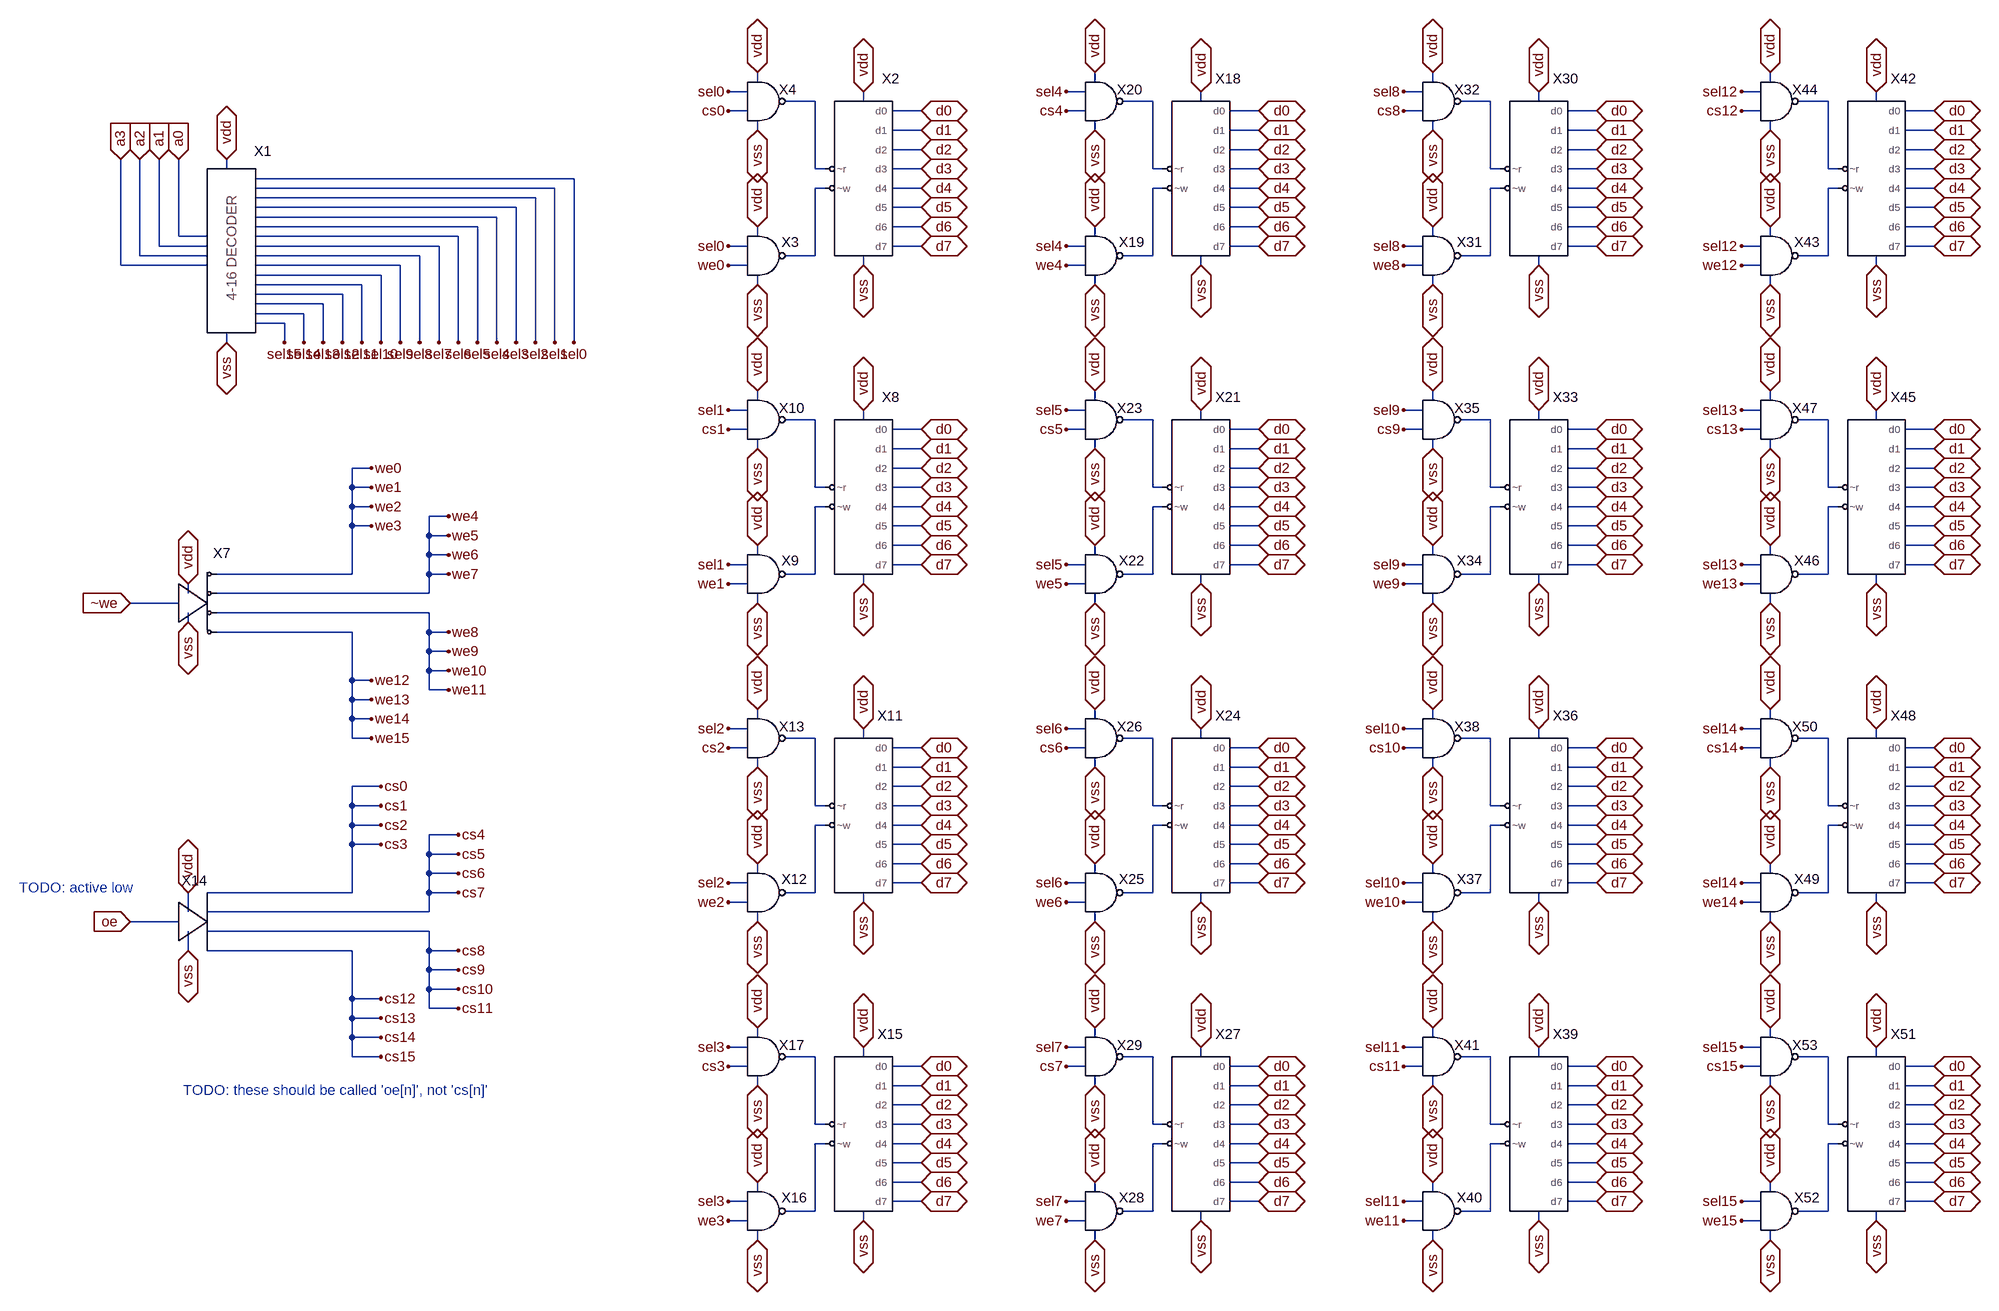
[diagram p0: schematic sram.asc]
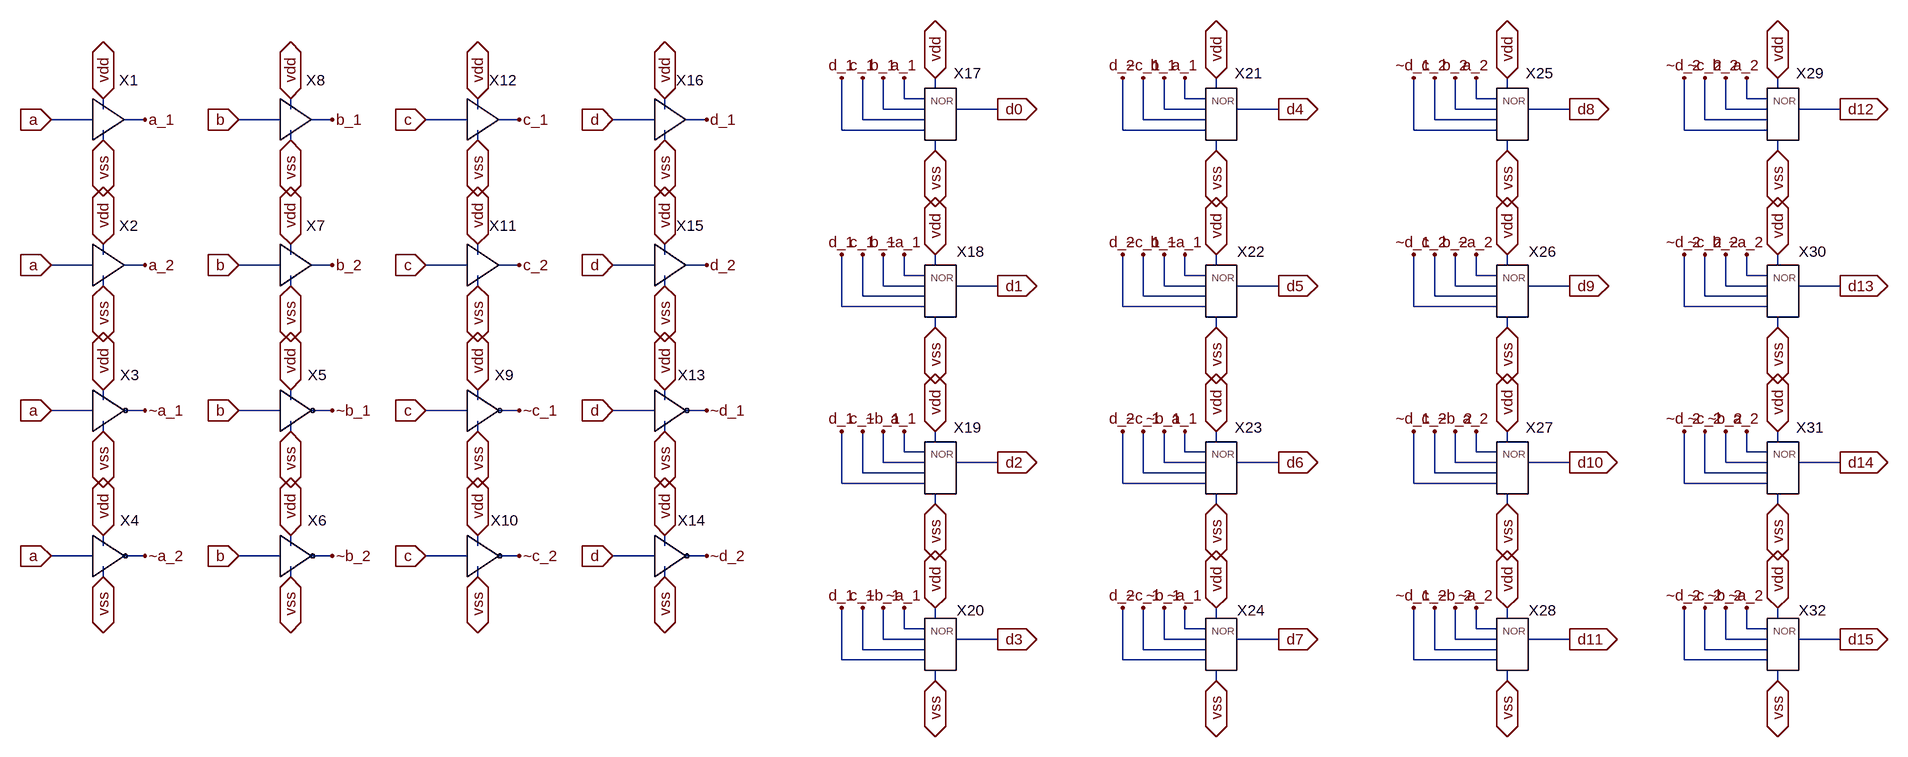
[diagram p1: sub-circuit 4_to_16_decoder.asc]
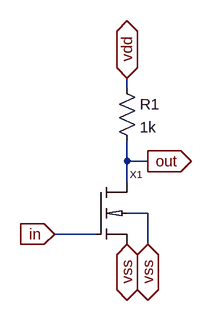
[diagram p2: sub-circuit not.asc]
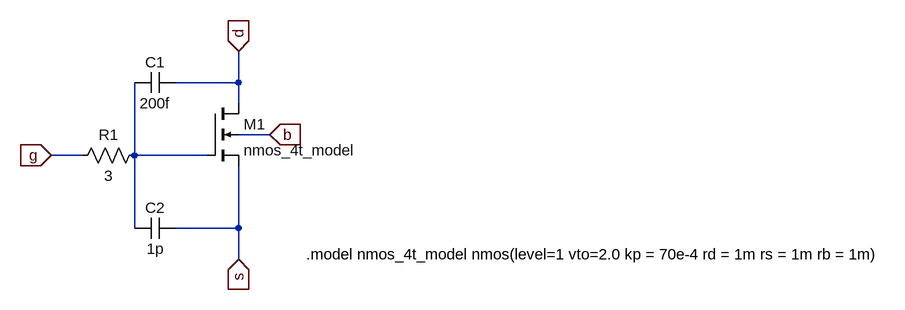
[diagram p3: sub-circuit nmos_4t.asc]
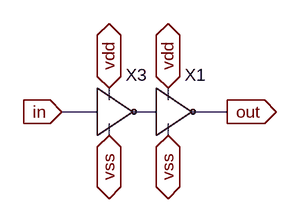
[diagram p4: sub-circuit buffer.asc]
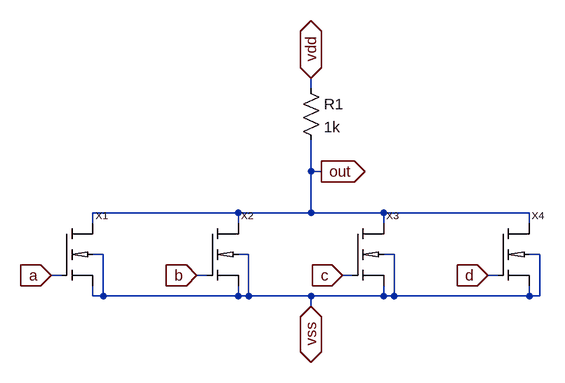
[diagram p5: sub-circuit 4_way_nor.asc]
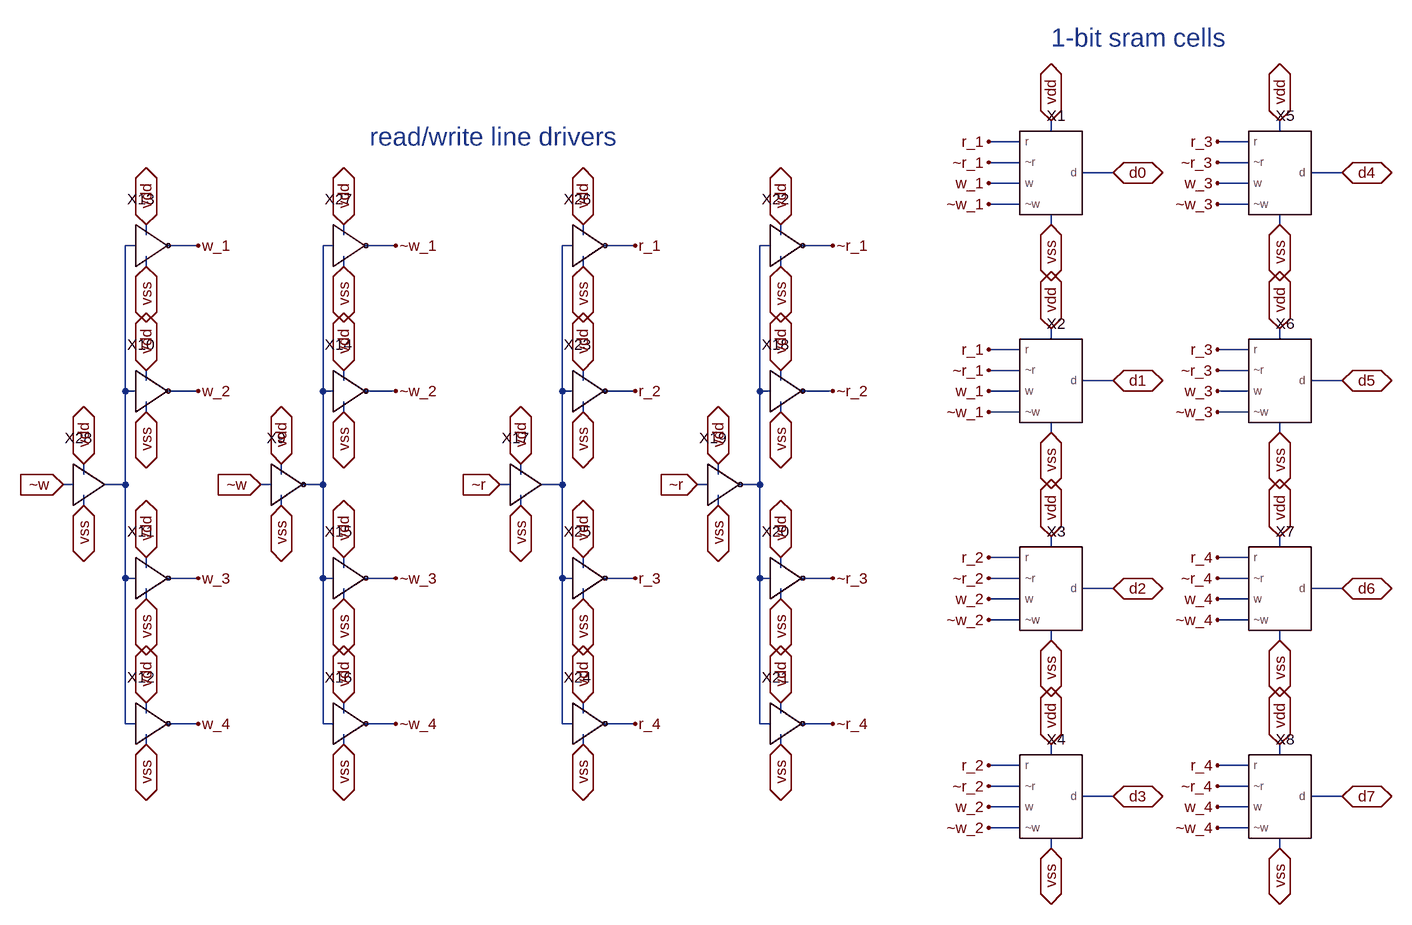
[diagram p6: sub-circuit 8_bit_sram_cell.asc]
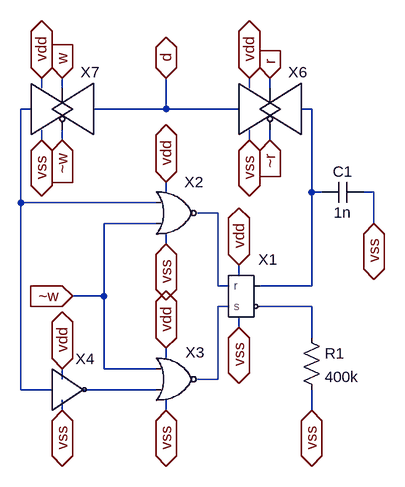
[diagram p7: sub-circuit 1_bit_sram_cell.asc]
sram.asc, the LTspice schematic file:
Version 4
SHEET 1 4580 2784
WIRE 1040 -160 1040 -176
WIRE 1600 -160 1600 -176
WIRE 2160 -160 2160 -176
WIRE 2720 -160 2720 -176
WIRE 1024 -144 992 -144
WIRE 1584 -144 1552 -144
WIRE 2144 -144 2112 -144
WIRE 2704 -144 2672 -144
WIRE 1136 -128 1088 -128
WIRE 1216 -128 1216 -144
WIRE 1696 -128 1648 -128
WIRE 1776 -128 1776 -144
WIRE 2256 -128 2208 -128
WIRE 2336 -128 2336 -144
WIRE 2816 -128 2768 -128
WIRE 2896 -128 2896 -144
WIRE 1024 -112 992 -112
WIRE 1312 -112 1264 -112
WIRE 1584 -112 1552 -112
WIRE 1872 -112 1824 -112
WIRE 2144 -112 2112 -112
WIRE 2432 -112 2384 -112
WIRE 2704 -112 2672 -112
WIRE 2992 -112 2944 -112
WIRE 1040 -80 1040 -96
WIRE 1312 -80 1264 -80
WIRE 1600 -80 1600 -96
WIRE 1872 -80 1824 -80
WIRE 2160 -80 2160 -96
WIRE 2432 -80 2384 -80
WIRE 2720 -80 2720 -96
WIRE 2992 -80 2944 -80
WIRE 1312 -48 1264 -48
WIRE 1872 -48 1824 -48
WIRE 2432 -48 2384 -48
WIRE 2992 -48 2944 -48
WIRE 160 -16 160 -32
WIRE 1136 -16 1136 -128
WIRE 1152 -16 1136 -16
WIRE 1312 -16 1264 -16
WIRE 1696 -16 1696 -128
WIRE 1712 -16 1696 -16
WIRE 1872 -16 1824 -16
WIRE 2256 -16 2256 -128
WIRE 2272 -16 2256 -16
WIRE 2432 -16 2384 -16
WIRE 2816 -16 2816 -128
WIRE 2832 -16 2816 -16
WIRE 2992 -16 2944 -16
WIRE 736 0 208 0
WIRE 704 16 208 16
WIRE 1152 16 1136 16
WIRE 1312 16 1264 16
WIRE 1712 16 1696 16
WIRE 1872 16 1824 16
WIRE 2272 16 2256 16
WIRE 2432 16 2384 16
WIRE 2832 16 2816 16
WIRE 2992 16 2944 16
WIRE 672 32 208 32
WIRE 640 48 208 48
WIRE 1312 48 1264 48
WIRE 1872 48 1824 48
WIRE 2432 48 2384 48
WIRE 2992 48 2944 48
WIRE 608 64 208 64
WIRE 576 80 208 80
WIRE 1312 80 1264 80
WIRE 1872 80 1824 80
WIRE 2432 80 2384 80
WIRE 2992 80 2944 80
WIRE 80 96 80 -32
WIRE 128 96 80 96
WIRE 544 96 208 96
WIRE 1040 96 1040 80
WIRE 1600 96 1600 80
WIRE 2160 96 2160 80
WIRE 2720 96 2720 80
WIRE 48 112 48 -32
WIRE 128 112 48 112
WIRE 512 112 208 112
WIRE 1024 112 992 112
WIRE 1312 112 1264 112
WIRE 1584 112 1552 112
WIRE 1872 112 1824 112
WIRE 2144 112 2112 112
WIRE 2432 112 2384 112
WIRE 2704 112 2672 112
WIRE 2992 112 2944 112
WIRE 16 128 16 -32
WIRE 128 128 16 128
WIRE 480 128 208 128
WIRE 1136 128 1136 16
WIRE 1136 128 1088 128
WIRE 1696 128 1696 16
WIRE 1696 128 1648 128
WIRE 2256 128 2256 16
WIRE 2256 128 2208 128
WIRE 2816 128 2816 16
WIRE 2816 128 2768 128
WIRE -16 144 -16 -32
WIRE 128 144 -16 144
WIRE 448 144 208 144
WIRE 1024 144 992 144
WIRE 1216 144 1216 128
WIRE 1584 144 1552 144
WIRE 1776 144 1776 128
WIRE 2144 144 2112 144
WIRE 2336 144 2336 128
WIRE 2704 144 2672 144
WIRE 2896 144 2896 128
WIRE 416 160 208 160
WIRE 384 176 208 176
WIRE 1040 176 1040 160
WIRE 1600 176 1600 160
WIRE 2160 176 2160 160
WIRE 2720 176 2720 160
WIRE 352 192 208 192
WIRE 320 208 208 208
WIRE 288 224 208 224
WIRE 256 240 208 240
WIRE 160 272 160 256
WIRE 256 272 256 240
WIRE 288 272 288 224
WIRE 320 272 320 208
WIRE 352 272 352 192
WIRE 384 272 384 176
WIRE 416 272 416 160
WIRE 448 272 448 144
WIRE 480 272 480 128
WIRE 512 272 512 112
WIRE 544 272 544 96
WIRE 576 272 576 80
WIRE 608 272 608 64
WIRE 640 272 640 48
WIRE 672 272 672 32
WIRE 704 272 704 16
WIRE 736 272 736 0
WIRE 1040 368 1040 352
WIRE 1600 368 1600 352
WIRE 2160 368 2160 352
WIRE 2720 368 2720 352
WIRE 1024 384 992 384
WIRE 1584 384 1552 384
WIRE 2144 384 2112 384
WIRE 2704 384 2672 384
WIRE 1136 400 1088 400
WIRE 1216 400 1216 384
WIRE 1696 400 1648 400
WIRE 1776 400 1776 384
WIRE 2256 400 2208 400
WIRE 2336 400 2336 384
WIRE 2816 400 2768 400
WIRE 2896 400 2896 384
WIRE 1024 416 992 416
WIRE 1312 416 1264 416
WIRE 1584 416 1552 416
WIRE 1872 416 1824 416
WIRE 2144 416 2112 416
WIRE 2432 416 2384 416
WIRE 2704 416 2672 416
WIRE 2992 416 2944 416
WIRE 1040 448 1040 432
WIRE 1312 448 1264 448
WIRE 1600 448 1600 432
WIRE 1872 448 1824 448
WIRE 2160 448 2160 432
WIRE 2432 448 2384 448
WIRE 2720 448 2720 432
WIRE 2992 448 2944 448
WIRE 400 480 368 480
WIRE 1312 480 1264 480
WIRE 1872 480 1824 480
WIRE 2432 480 2384 480
WIRE 2992 480 2944 480
WIRE 368 512 368 480
WIRE 400 512 368 512
WIRE 1136 512 1136 400
WIRE 1152 512 1136 512
WIRE 1312 512 1264 512
WIRE 1696 512 1696 400
WIRE 1712 512 1696 512
WIRE 1872 512 1824 512
WIRE 2256 512 2256 400
WIRE 2272 512 2256 512
WIRE 2432 512 2384 512
WIRE 2816 512 2816 400
WIRE 2832 512 2816 512
WIRE 2992 512 2944 512
WIRE 368 544 368 512
WIRE 400 544 368 544
WIRE 1152 544 1136 544
WIRE 1312 544 1264 544
WIRE 1712 544 1696 544
WIRE 1872 544 1824 544
WIRE 2272 544 2256 544
WIRE 2432 544 2384 544
WIRE 2832 544 2816 544
WIRE 2992 544 2944 544
WIRE 528 560 496 560
WIRE 368 576 368 544
WIRE 400 576 368 576
WIRE 1312 576 1264 576
WIRE 1872 576 1824 576
WIRE 2432 576 2384 576
WIRE 2992 576 2944 576
WIRE 496 592 496 560
WIRE 528 592 496 592
WIRE 1312 608 1264 608
WIRE 1872 608 1824 608
WIRE 2432 608 2384 608
WIRE 2992 608 2944 608
WIRE 496 624 496 592
WIRE 528 624 496 624
WIRE 1040 624 1040 608
WIRE 1600 624 1600 608
WIRE 2160 624 2160 608
WIRE 2720 624 2720 608
WIRE 1024 640 992 640
WIRE 1312 640 1264 640
WIRE 1584 640 1552 640
WIRE 1872 640 1824 640
WIRE 2144 640 2112 640
WIRE 2432 640 2384 640
WIRE 2704 640 2672 640
WIRE 2992 640 2944 640
WIRE 368 656 368 576
WIRE 368 656 144 656
WIRE 496 656 496 624
WIRE 528 656 496 656
WIRE 1136 656 1136 544
WIRE 1136 656 1088 656
WIRE 1696 656 1696 544
WIRE 1696 656 1648 656
WIRE 2256 656 2256 544
WIRE 2256 656 2208 656
WIRE 2816 656 2816 544
WIRE 2816 656 2768 656
WIRE 1024 672 992 672
WIRE 1216 672 1216 656
WIRE 1584 672 1552 672
WIRE 1776 672 1776 656
WIRE 2144 672 2112 672
WIRE 2336 672 2336 656
WIRE 2704 672 2672 672
WIRE 2896 672 2896 656
WIRE 96 688 96 672
WIRE 496 688 496 656
WIRE 496 688 144 688
WIRE 80 704 0 704
WIRE 1040 704 1040 688
WIRE 1600 704 1600 688
WIRE 2160 704 2160 688
WIRE 2720 704 2720 688
WIRE 496 720 144 720
WIRE 96 736 96 720
WIRE 368 752 144 752
WIRE 496 752 496 720
WIRE 528 752 496 752
WIRE 496 784 496 752
WIRE 528 784 496 784
WIRE 496 816 496 784
WIRE 528 816 496 816
WIRE 368 832 368 752
WIRE 400 832 368 832
WIRE 496 848 496 816
WIRE 528 848 496 848
WIRE 368 864 368 832
WIRE 400 864 368 864
WIRE 368 896 368 864
WIRE 400 896 368 896
WIRE 1040 896 1040 880
WIRE 1600 896 1600 880
WIRE 2160 896 2160 880
WIRE 2720 896 2720 880
WIRE 1024 912 992 912
WIRE 1584 912 1552 912
WIRE 2144 912 2112 912
WIRE 2704 912 2672 912
WIRE 368 928 368 896
WIRE 400 928 368 928
WIRE 1136 928 1088 928
WIRE 1216 928 1216 912
WIRE 1696 928 1648 928
WIRE 1776 928 1776 912
WIRE 2256 928 2208 928
WIRE 2336 928 2336 912
WIRE 2816 928 2768 928
WIRE 2896 928 2896 912
WIRE 1024 944 992 944
WIRE 1312 944 1264 944
WIRE 1584 944 1552 944
WIRE 1872 944 1824 944
WIRE 2144 944 2112 944
WIRE 2432 944 2384 944
WIRE 2704 944 2672 944
WIRE 2992 944 2944 944
WIRE 1040 976 1040 960
WIRE 1312 976 1264 976
WIRE 1600 976 1600 960
WIRE 1872 976 1824 976
WIRE 2160 976 2160 960
WIRE 2432 976 2384 976
WIRE 2720 976 2720 960
WIRE 2992 976 2944 976
WIRE 416 1008 368 1008
WIRE 1312 1008 1264 1008
WIRE 1872 1008 1824 1008
WIRE 2432 1008 2384 1008
WIRE 2992 1008 2944 1008
WIRE 368 1040 368 1008
WIRE 416 1040 368 1040
WIRE 1136 1040 1136 928
WIRE 1152 1040 1136 1040
WIRE 1312 1040 1264 1040
WIRE 1696 1040 1696 928
WIRE 1712 1040 1696 1040
WIRE 1872 1040 1824 1040
WIRE 2256 1040 2256 928
WIRE 2272 1040 2256 1040
WIRE 2432 1040 2384 1040
WIRE 2816 1040 2816 928
WIRE 2832 1040 2816 1040
WIRE 2992 1040 2944 1040
WIRE 368 1072 368 1040
WIRE 416 1072 368 1072
WIRE 1152 1072 1136 1072
WIRE 1312 1072 1264 1072
WIRE 1712 1072 1696 1072
WIRE 1872 1072 1824 1072
WIRE 2272 1072 2256 1072
WIRE 2432 1072 2384 1072
WIRE 2832 1072 2816 1072
WIRE 2992 1072 2944 1072
WIRE 544 1088 496 1088
WIRE 368 1104 368 1072
WIRE 416 1104 368 1104
WIRE 1312 1104 1264 1104
WIRE 1872 1104 1824 1104
WIRE 2432 1104 2384 1104
WIRE 2992 1104 2944 1104
WIRE 496 1120 496 1088
WIRE 544 1120 496 1120
WIRE 1312 1136 1264 1136
WIRE 1872 1136 1824 1136
WIRE 2432 1136 2384 1136
WIRE 2992 1136 2944 1136
WIRE 496 1152 496 1120
WIRE 544 1152 496 1152
WIRE 1040 1152 1040 1136
WIRE 1600 1152 1600 1136
WIRE 2160 1152 2160 1136
WIRE 2720 1152 2720 1136
WIRE 1024 1168 992 1168
WIRE 1312 1168 1264 1168
WIRE 1584 1168 1552 1168
WIRE 1872 1168 1824 1168
WIRE 2144 1168 2112 1168
WIRE 2432 1168 2384 1168
WIRE 2704 1168 2672 1168
WIRE 2992 1168 2944 1168
WIRE 368 1184 368 1104
WIRE 368 1184 128 1184
WIRE 496 1184 496 1152
WIRE 544 1184 496 1184
WIRE 1136 1184 1136 1072
WIRE 1136 1184 1088 1184
WIRE 1696 1184 1696 1072
WIRE 1696 1184 1648 1184
WIRE 2256 1184 2256 1072
WIRE 2256 1184 2208 1184
WIRE 2816 1184 2816 1072
WIRE 2816 1184 2768 1184
WIRE 1024 1200 992 1200
WIRE 1216 1200 1216 1184
WIRE 1584 1200 1552 1200
WIRE 1776 1200 1776 1184
WIRE 2144 1200 2112 1200
WIRE 2336 1200 2336 1184
WIRE 2704 1200 2672 1200
WIRE 2896 1200 2896 1184
WIRE 96 1216 96 1184
WIRE 496 1216 496 1184
WIRE 496 1216 128 1216
WIRE 80 1232 0 1232
WIRE 1040 1232 1040 1216
WIRE 1600 1232 1600 1216
WIRE 2160 1232 2160 1216
WIRE 2720 1232 2720 1216
WIRE 496 1248 128 1248
WIRE 96 1280 96 1248
WIRE 368 1280 128 1280
WIRE 496 1280 496 1248
WIRE 544 1280 496 1280
WIRE 496 1312 496 1280
WIRE 544 1312 496 1312
WIRE 496 1344 496 1312
WIRE 544 1344 496 1344
WIRE 368 1360 368 1280
WIRE 416 1360 368 1360
WIRE 496 1376 496 1344
WIRE 544 1376 496 1376
WIRE 368 1392 368 1360
WIRE 416 1392 368 1392
WIRE 368 1424 368 1392
WIRE 416 1424 368 1424
WIRE 1040 1424 1040 1408
WIRE 1600 1424 1600 1408
WIRE 2160 1424 2160 1408
WIRE 2720 1424 2720 1408
WIRE 1024 1440 992 1440
WIRE 1584 1440 1552 1440
WIRE 2144 1440 2112 1440
WIRE 2704 1440 2672 1440
WIRE 368 1456 368 1424
WIRE 416 1456 368 1456
WIRE 1136 1456 1088 1456
WIRE 1216 1456 1216 1440
WIRE 1696 1456 1648 1456
WIRE 1776 1456 1776 1440
WIRE 2256 1456 2208 1456
WIRE 2336 1456 2336 1440
WIRE 2816 1456 2768 1456
WIRE 2896 1456 2896 1440
WIRE 1024 1472 992 1472
WIRE 1312 1472 1264 1472
WIRE 1584 1472 1552 1472
WIRE 1872 1472 1824 1472
WIRE 2144 1472 2112 1472
WIRE 2432 1472 2384 1472
WIRE 2704 1472 2672 1472
WIRE 2992 1472 2944 1472
WIRE 1040 1504 1040 1488
WIRE 1312 1504 1264 1504
WIRE 1600 1504 1600 1488
WIRE 1872 1504 1824 1504
WIRE 2160 1504 2160 1488
WIRE 2432 1504 2384 1504
WIRE 2720 1504 2720 1488
WIRE 2992 1504 2944 1504
WIRE 1312 1536 1264 1536
WIRE 1872 1536 1824 1536
WIRE 2432 1536 2384 1536
WIRE 2992 1536 2944 1536
WIRE 1136 1568 1136 1456
WIRE 1152 1568 1136 1568
WIRE 1312 1568 1264 1568
WIRE 1696 1568 1696 1456
WIRE 1712 1568 1696 1568
WIRE 1872 1568 1824 1568
WIRE 2256 1568 2256 1456
WIRE 2272 1568 2256 1568
WIRE 2432 1568 2384 1568
WIRE 2816 1568 2816 1456
WIRE 2832 1568 2816 1568
WIRE 2992 1568 2944 1568
WIRE 1152 1600 1136 1600
WIRE 1312 1600 1264 1600
WIRE 1712 1600 1696 1600
WIRE 1872 1600 1824 1600
WIRE 2272 1600 2256 1600
WIRE 2432 1600 2384 1600
WIRE 2832 1600 2816 1600
WIRE 2992 1600 2944 1600
WIRE 1312 1632 1264 1632
WIRE 1872 1632 1824 1632
WIRE 2432 1632 2384 1632
WIRE 2992 1632 2944 1632
WIRE 1312 1664 1264 1664
WIRE 1872 1664 1824 1664
WIRE 2432 1664 2384 1664
WIRE 2992 1664 2944 1664
WIRE 1040 1680 1040 1664
WIRE 1600 1680 1600 1664
WIRE 2160 1680 2160 1664
WIRE 2720 1680 2720 1664
WIRE 1024 1696 992 1696
WIRE 1312 1696 1264 1696
WIRE 1584 1696 1552 1696
WIRE 1872 1696 1824 1696
WIRE 2144 1696 2112 1696
WIRE 2432 1696 2384 1696
WIRE 2704 1696 2672 1696
WIRE 2992 1696 2944 1696
WIRE 1136 1712 1136 1600
WIRE 1136 1712 1088 1712
WIRE 1696 1712 1696 1600
WIRE 1696 1712 1648 1712
WIRE 2256 1712 2256 1600
WIRE 2256 1712 2208 1712
WIRE 2816 1712 2816 1600
WIRE 2816 1712 2768 1712
WIRE 1024 1728 992 1728
WIRE 1216 1728 1216 1712
WIRE 1584 1728 1552 1728
WIRE 1776 1728 1776 1712
WIRE 2144 1728 2112 1728
WIRE 2336 1728 2336 1712
WIRE 2704 1728 2672 1728
WIRE 2896 1728 2896 1712
WIRE 1040 1760 1040 1744
WIRE 1600 1760 1600 1744
WIRE 2160 1760 2160 1744
WIRE 2720 1760 2720 1744
FLAG 736 272 sel0
FLAG 704 272 sel1
FLAG 672 272 sel2
FLAG 640 272 sel3
FLAG 608 272 sel4
FLAG 576 272 sel5
FLAG 544 272 sel6
FLAG 512 272 sel7
FLAG 480 272 sel8
FLAG 448 272 sel9
FLAG 416 272 sel10
FLAG 384 272 sel11
FLAG 352 272 sel12
FLAG 320 272 sel13
FLAG 288 272 sel14
FLAG 256 272 sel15
FLAG 80 -32 a0
IOPIN 80 -32 In
FLAG 48 -32 a1
IOPIN 48 -32 In
FLAG 16 -32 a2
IOPIN 16 -32 In
FLAG -16 -32 a3
IOPIN -16 -32 In
FLAG 992 112 sel0
FLAG 992 144 we0
FLAG 992 -144 sel0
FLAG 992 -112 cs0
FLAG 0 704 ~we
IOPIN 0 704 In
FLAG 400 480 we0
FLAG 400 512 we1
FLAG 400 544 we2
FLAG 400 576 we3
FLAG 528 560 we4
FLAG 528 592 we5
FLAG 528 624 we6
FLAG 528 656 we7
FLAG 528 752 we8
FLAG 528 784 we9
FLAG 528 816 we10
FLAG 528 848 we11
FLAG 400 832 we12
FLAG 400 864 we13
FLAG 400 896 we14
FLAG 400 928 we15
FLAG 1040 -80 vss
IOPIN 1040 -80 BiDir
FLAG 1040 80 vdd
IOPIN 1040 80 BiDir
FLAG 1040 -176 vdd
IOPIN 1040 -176 BiDir
FLAG 1040 176 vss
IOPIN 1040 176 BiDir
FLAG 1216 144 vss
IOPIN 1216 144 BiDir
FLAG 1216 -144 vdd
IOPIN 1216 -144 BiDir
FLAG 992 640 sel1
FLAG 992 672 we1
FLAG 992 384 sel1
FLAG 992 416 cs1
FLAG 1040 448 vss
IOPIN 1040 448 BiDir
FLAG 1040 608 vdd
IOPIN 1040 608 BiDir
FLAG 1040 352 vdd
IOPIN 1040 352 BiDir
FLAG 1040 704 vss
IOPIN 1040 704 BiDir
FLAG 1216 672 vss
IOPIN 1216 672 BiDir
FLAG 1216 384 vdd
IOPIN 1216 384 BiDir
FLAG 992 1168 sel2
FLAG 992 1200 we2
FLAG 992 912 sel2
FLAG 992 944 cs2
FLAG 1040 976 vss
IOPIN 1040 976 BiDir
FLAG 1040 1136 vdd
IOPIN 1040 1136 BiDir
FLAG 1040 880 vdd
IOPIN 1040 880 BiDir
FLAG 1040 1232 vss
IOPIN 1040 1232 BiDir
FLAG 1216 1200 vss
IOPIN 1216 1200 BiDir
FLAG 1216 912 vdd
IOPIN 1216 912 BiDir
FLAG 0 1232 oe
IOPIN 0 1232 In
FLAG 416 1008 cs0
FLAG 416 1040 cs1
FLAG 416 1072 cs2
FLAG 416 1104 cs3
FLAG 544 1088 cs4
FLAG 544 1120 cs5
FLAG 544 1152 cs6
FLAG 544 1184 cs7
FLAG 544 1280 cs8
FLAG 544 1312 cs9
FLAG 544 1344 cs10
FLAG 544 1376 cs11
FLAG 416 1360 cs12
FLAG 416 1392 cs13
FLAG 416 1424 cs14
FLAG 416 1456 cs15
FLAG 96 1280 vss
IOPIN 96 1280 BiDir
FLAG 96 1184 vdd
IOPIN 96 1184 BiDir
FLAG 992 1696 sel3
FLAG 992 1728 we3
FLAG 992 1440 sel3
FLAG 992 1472 cs3
FLAG 1040 1504 vss
IOPIN 1040 1504 BiDir
FLAG 1040 1664 vdd
IOPIN 1040 1664 BiDir
FLAG 1040 1408 vdd
IOPIN 1040 1408 BiDir
FLAG 1040 1760 vss
IOPIN 1040 1760 BiDir
FLAG 1216 1728 vss
IOPIN 1216 1728 BiDir
FLAG 1216 1440 vdd
IOPIN 1216 1440 BiDir
FLAG 1552 112 sel4
FLAG 1552 144 we4
FLAG 1552 -144 sel4
FLAG 1552 -112 cs4
FLAG 1600 -80 vss
IOPIN 1600 -80 BiDir
FLAG 1600 80 vdd
IOPIN 1600 80 BiDir
FLAG 1600 -176 vdd
IOPIN 1600 -176 BiDir
FLAG 1600 176 vss
IOPIN 1600 176 BiDir
FLAG 1776 144 vss
IOPIN 1776 144 BiDir
FLAG 1776 -144 vdd
IOPIN 1776 -144 BiDir
FLAG 1552 640 sel5
FLAG 1552 672 we5
FLAG 1552 384 sel5
FLAG 1552 416 cs5
FLAG 1600 448 vss
IOPIN 1600 448 BiDir
FLAG 1600 608 vdd
IOPIN 1600 608 BiDir
FLAG 1600 352 vdd
IOPIN 1600 352 BiDir
FLAG 1600 704 vss
IOPIN 1600 704 BiDir
FLAG 1776 672 vss
IOPIN 1776 672 BiDir
FLAG 1776 384 vdd
IOPIN 1776 384 BiDir
FLAG 1552 1168 sel6
FLAG 1552 1200 we6
FLAG 1552 912 sel6
FLAG 1552 944 cs6
FLAG 1600 976 vss
IOPIN 1600 976 BiDir
FLAG 1600 1136 vdd
IOPIN 1600 1136 BiDir
FLAG 1600 880 vdd
IOPIN 1600 880 BiDir
FLAG 1600 1232 vss
IOPIN 1600 1232 BiDir
FLAG 1776 1200 vss
IOPIN 1776 1200 BiDir
FLAG 1776 912 vdd
IOPIN 1776 912 BiDir
FLAG 1552 1696 sel7
FLAG 1552 1728 we7
FLAG 1552 1440 sel7
FLAG 1552 1472 cs7
FLAG 1600 1504 vss
IOPIN 1600 1504 BiDir
FLAG 1600 1664 vdd
IOPIN 1600 1664 BiDir
FLAG 1600 1408 vdd
IOPIN 1600 1408 BiDir
FLAG 1600 1760 vss
IOPIN 1600 1760 BiDir
FLAG 1776 1728 vss
IOPIN 1776 1728 BiDir
FLAG 1776 1440 vdd
IOPIN 1776 1440 BiDir
FLAG 2112 112 sel8
FLAG 2112 144 we8
FLAG 2112 -144 sel8
FLAG 2112 -112 cs8
FLAG 2160 -80 vss
IOPIN 2160 -80 BiDir
FLAG 2160 80 vdd
IOPIN 2160 80 BiDir
FLAG 2160 -176 vdd
IOPIN 2160 -176 BiDir
FLAG 2160 176 vss
IOPIN 2160 176 BiDir
FLAG 2336 144 vss
IOPIN 2336 144 BiDir
FLAG 2336 -144 vdd
IOPIN 2336 -144 BiDir
FLAG 2112 640 sel9
FLAG 2112 672 we9
FLAG 2112 384 sel9
FLAG 2112 416 cs9
FLAG 2160 448 vss
IOPIN 2160 448 BiDir
FLAG 2160 608 vdd
IOPIN 2160 608 BiDir
FLAG 2160 352 vdd
IOPIN 2160 352 BiDir
FLAG 2160 704 vss
IOPIN 2160 704 BiDir
FLAG 2336 672 vss
IOPIN 2336 672 BiDir
FLAG 2336 384 vdd
IOPIN 2336 384 BiDir
FLAG 2112 1168 sel10
FLAG 2112 1200 we10
FLAG 2112 912 sel10
FLAG 2112 944 cs10
FLAG 2160 976 vss
IOPIN 2160 976 BiDir
FLAG 2160 1136 vdd
IOPIN 2160 1136 BiDir
FLAG 2160 880 vdd
IOPIN 2160 880 BiDir
FLAG 2160 1232 vss
IOPIN 2160 1232 BiDir
FLAG 2336 1200 vss
IOPIN 2336 1200 BiDir
FLAG 2336 912 vdd
IOPIN 2336 912 BiDir
FLAG 2112 1696 sel11
FLAG 2112 1728 we11
FLAG 2112 1440 sel11
FLAG 2112 1472 cs11
FLAG 2160 1504 vss
IOPIN 2160 1504 BiDir
FLAG 2160 1664 vdd
IOPIN 2160 1664 BiDir
FLAG 2160 1408 vdd
IOPIN 2160 1408 BiDir
FLAG 2160 1760 vss
IOPIN 2160 1760 BiDir
FLAG 2336 1728 vss
IOPIN 2336 1728 BiDir
FLAG 2336 1440 vdd
IOPIN 2336 1440 BiDir
FLAG 2672 112 sel12
FLAG 2672 144 we12
FLAG 2672 -144 sel12
FLAG 2672 -112 cs12
FLAG 2720 -80 vss
IOPIN 2720 -80 BiDir
FLAG 2720 80 vdd
IOPIN 2720 80 BiDir
FLAG 2720 -176 vdd
IOPIN 2720 -176 BiDir
FLAG 2720 176 vss
IOPIN 2720 176 BiDir
FLAG 2896 144 vss
IOPIN 2896 144 BiDir
FLAG 2896 -144 vdd
IOPIN 2896 -144 BiDir
FLAG 2672 640 sel13
FLAG 2672 672 we13
FLAG 2672 384 sel13
FLAG 2672 416 cs13
FLAG 2720 448 vss
IOPIN 2720 448 BiDir
FLAG 2720 608 vdd
IOPIN 2720 608 BiDir
FLAG 2720 352 vdd
IOPIN 2720 352 BiDir
FLAG 2720 704 vss
IOPIN 2720 704 BiDir
FLAG 2896 672 vss
IOPIN 2896 672 BiDir
FLAG 2896 384 vdd
IOPIN 2896 384 BiDir
FLAG 2672 1168 sel14
FLAG 2672 1200 we14
FLAG 2672 912 sel14
FLAG 2672 944 cs14
FLAG 2720 976 vss
IOPIN 2720 976 BiDir
FLAG 2720 1136 vdd
IOPIN 2720 1136 BiDir
FLAG 2720 880 vdd
IOPIN 2720 880 BiDir
FLAG 2720 1232 vss
IOPIN 2720 1232 BiDir
FLAG 2896 1200 vss
IOPIN 2896 1200 BiDir
FLAG 2896 912 vdd
IOPIN 2896 912 BiDir
FLAG 2672 1696 sel15
FLAG 2672 1728 we15
FLAG 2672 1440 sel15
FLAG 2672 1472 cs15
FLAG 2720 1504 vss
IOPIN 2720 1504 BiDir
FLAG 2720 1664 vdd
IOPIN 2720 1664 BiDir
FLAG 2720 1408 vdd
IOPIN 2720 1408 BiDir
FLAG 2720 1760 vss
IOPIN 2720 1760 BiDir
FLAG 2896 1728 vss
IOPIN 2896 1728 BiDir
FLAG 2896 1440 vdd
IOPIN 2896 1440 BiDir
FLAG 160 -32 vdd
IOPIN 160 -32 BiDir
FLAG 160 272 vss
IOPIN 160 272 BiDir
FLAG 2992 -80 d1
IOPIN 2992 -80 BiDir
FLAG 2992 -48 d2
IOPIN 2992 -48 BiDir
FLAG 2992 -16 d3
IOPIN 2992 -16 BiDir
FLAG 2992 16 d4
IOPIN 2992 16 BiDir
FLAG 2992 48 d5
IOPIN 2992 48 BiDir
FLAG 2992 80 d6
IOPIN 2992 80 BiDir
FLAG 2992 112 d7
IOPIN 2992 112 BiDir
FLAG 2992 -112 d0
IOPIN 2992 -112 BiDir
FLAG 2992 448 d1
IOPIN 2992 448 BiDir
FLAG 2992 480 d2
IOPIN 2992 480 BiDir
FLAG 2992 512 d3
IOPIN 2992 512 BiDir
FLAG 2992 544 d4
IOPIN 2992 544 BiDir
FLAG 2992 576 d5
IOPIN 2992 576 BiDir
FLAG 2992 608 d6
IOPIN 2992 608 BiDir
FLAG 2992 640 d7
IOPIN 2992 640 BiDir
FLAG 2992 416 d0
IOPIN 2992 416 BiDir
FLAG 2992 976 d1
IOPIN 2992 976 BiDir
FLAG 2992 1008 d2
IOPIN 2992 1008 BiDir
FLAG 2992 1040 d3
IOPIN 2992 1040 BiDir
FLAG 2992 1072 d4
IOPIN 2992 1072 BiDir
FLAG 2992 1104 d5
IOPIN 2992 1104 BiDir
FLAG 2992 1136 d6
IOPIN 2992 1136 BiDir
FLAG 2992 1168 d7
IOPIN 2992 1168 BiDir
FLAG 2992 944 d0
IOPIN 2992 944 BiDir
FLAG 2992 1504 d1
IOPIN 2992 1504 BiDir
FLAG 2992 1536 d2
IOPIN 2992 1536 BiDir
FLAG 2992 1568 d3
IOPIN 2992 1568 BiDir
FLAG 2992 1600 d4
IOPIN 2992 1600 BiDir
FLAG 2992 1632 d5
IOPIN 2992 1632 BiDir
FLAG 2992 1664 d6
IOPIN 2992 1664 BiDir
FLAG 2992 1696 d7
IOPIN 2992 1696 BiDir
FLAG 2992 1472 d0
IOPIN 2992 1472 BiDir
FLAG 2432 -80 d1
IOPIN 2432 -80 BiDir
FLAG 2432 -48 d2
IOPIN 2432 -48 BiDir
FLAG 2432 -16 d3
IOPIN 2432 -16 BiDir
FLAG 2432 16 d4
IOPIN 2432 16 BiDir
FLAG 2432 48 d5
IOPIN 2432 48 BiDir
FLAG 2432 80 d6
IOPIN 2432 80 BiDir
FLAG 2432 112 d7
IOPIN 2432 112 BiDir
FLAG 2432 -112 d0
IOPIN 2432 -112 BiDir
FLAG 2432 448 d1
IOPIN 2432 448 BiDir
FLAG 2432 480 d2
IOPIN 2432 480 BiDir
FLAG 2432 512 d3
IOPIN 2432 512 BiDir
FLAG 2432 544 d4
IOPIN 2432 544 BiDir
FLAG 2432 576 d5
IOPIN 2432 576 BiDir
FLAG 2432 608 d6
IOPIN 2432 608 BiDir
FLAG 2432 640 d7
IOPIN 2432 640 BiDir
FLAG 2432 416 d0
IOPIN 2432 416 BiDir
FLAG 2432 976 d1
IOPIN 2432 976 BiDir
FLAG 2432 1008 d2
IOPIN 2432 1008 BiDir
FLAG 2432 1040 d3
IOPIN 2432 1040 BiDir
FLAG 2432 1072 d4
IOPIN 2432 1072 BiDir
FLAG 2432 1104 d5
IOPIN 2432 1104 BiDir
FLAG 2432 1136 d6
IOPIN 2432 1136 BiDir
FLAG 2432 1168 d7
IOPIN 2432 1168 BiDir
FLAG 2432 944 d0
IOPIN 2432 944 BiDir
FLAG 2432 1504 d1
IOPIN 2432 1504 BiDir
FLAG 2432 1536 d2
IOPIN 2432 1536 BiDir
FLAG 2432 1568 d3
IOPIN 2432 1568 BiDir
FLAG 2432 1600 d4
IOPIN 2432 1600 BiDir
FLAG 2432 1632 d5
IOPIN 2432 1632 BiDir
FLAG 2432 1664 d6
IOPIN 2432 1664 BiDir
FLAG 2432 1696 d7
IOPIN 2432 1696 BiDir
FLAG 2432 1472 d0
IOPIN 2432 1472 BiDir
FLAG 1872 -80 d1
IOPIN 1872 -80 BiDir
FLAG 1872 -48 d2
IOPIN 1872 -48 BiDir
FLAG 1872 -16 d3
IOPIN 1872 -16 BiDir
FLAG 1872 16 d4
IOPIN 1872 16 BiDir
FLAG 1872 48 d5
IOPIN 1872 48 BiDir
FLAG 1872 80 d6
IOPIN 1872 80 BiDir
FLAG 1872 112 d7
IOPIN 1872 112 BiDir
FLAG 1872 -112 d0
IOPIN 1872 -112 BiDir
FLAG 1872 448 d1
IOPIN 1872 448 BiDir
FLAG 1872 480 d2
IOPIN 1872 480 BiDir
FLAG 1872 512 d3
IOPIN 1872 512 BiDir
FLAG 1872 544 d4
IOPIN 1872 544 BiDir
FLAG 1872 576 d5
IOPIN 1872 576 BiDir
FLAG 1872 608 d6
IOPIN 1872 608 BiDir
FLAG 1872 640 d7
IOPIN 1872 640 BiDir
FLAG 1872 416 d0
IOPIN 1872 416 BiDir
FLAG 1872 976 d1
IOPIN 1872 976 BiDir
FLAG 1872 1008 d2
IOPIN 1872 1008 BiDir
FLAG 1872 1040 d3
IOPIN 1872 1040 BiDir
FLAG 1872 1072 d4
IOPIN 1872 1072 BiDir
FLAG 1872 1104 d5
IOPIN 1872 1104 BiDir
FLAG 1872 1136 d6
IOPIN 1872 1136 BiDir
FLAG 1872 1168 d7
IOPIN 1872 1168 BiDir
FLAG 1872 944 d0
IOPIN 1872 944 BiDir
FLAG 1872 1504 d1
IOPIN 1872 1504 BiDir
FLAG 1872 1536 d2
IOPIN 1872 1536 BiDir
FLAG 1872 1568 d3
IOPIN 1872 1568 BiDir
FLAG 1872 1600 d4
IOPIN 1872 1600 BiDir
FLAG 1872 1632 d5
IOPIN 1872 1632 BiDir
FLAG 1872 1664 d6
IOPIN 1872 1664 BiDir
FLAG 1872 1696 d7
IOPIN 1872 1696 BiDir
FLAG 1872 1472 d0
IOPIN 1872 1472 BiDir
FLAG 1312 -80 d1
IOPIN 1312 -80 BiDir
FLAG 1312 -48 d2
IOPIN 1312 -48 BiDir
FLAG 1312 -16 d3
IOPIN 1312 -16 BiDir
FLAG 1312 16 d4
IOPIN 1312 16 BiDir
FLAG 1312 48 d5
IOPIN 1312 48 BiDir
FLAG 1312 80 d6
IOPIN 1312 80 BiDir
FLAG 1312 112 d7
IOPIN 1312 112 BiDir
FLAG 1312 -112 d0
IOPIN 1312 -112 BiDir
FLAG 1312 448 d1
IOPIN 1312 448 BiDir
FLAG 1312 480 d2
IOPIN 1312 480 BiDir
FLAG 1312 512 d3
IOPIN 1312 512 BiDir
FLAG 1312 544 d4
IOPIN 1312 544 BiDir
FLAG 1312 576 d5
IOPIN 1312 576 BiDir
FLAG 1312 608 d6
IOPIN 1312 608 BiDir
FLAG 1312 640 d7
IOPIN 1312 640 BiDir
FLAG 1312 416 d0
IOPIN 1312 416 BiDir
FLAG 1312 976 d1
IOPIN 1312 976 BiDir
FLAG 1312 1008 d2
IOPIN 1312 1008 BiDir
FLAG 1312 1040 d3
IOPIN 1312 1040 BiDir
FLAG 1312 1072 d4
IOPIN 1312 1072 BiDir
FLAG 1312 1104 d5
IOPIN 1312 1104 BiDir
FLAG 1312 1136 d6
IOPIN 1312 1136 BiDir
FLAG 1312 1168 d7
IOPIN 1312 1168 BiDir
FLAG 1312 944 d0
IOPIN 1312 944 BiDir
FLAG 1312 1504 d1
IOPIN 1312 1504 BiDir
FLAG 1312 1536 d2
IOPIN 1312 1536 BiDir
FLAG 1312 1568 d3
IOPIN 1312 1568 BiDir
FLAG 1312 1600 d4
IOPIN 1312 1600 BiDir
FLAG 1312 1632 d5
IOPIN 1312 1632 BiDir
FLAG 1312 1664 d6
IOPIN 1312 1664 BiDir
FLAG 1312 1696 d7
IOPIN 1312 1696 BiDir
FLAG 1312 1472 d0
IOPIN 1312 1472 BiDir
FLAG 96 736 vss
IOPIN 96 736 BiDir
FLAG 96 672 vdd
IOPIN 96 672 BiDir
SYMBOL 4_to_16_decoder 176 272 R0
WINDOW 0 44 -302 Bottom 2
SYMATTR InstName X1
SYMBOL 8_bit_sram_cell 1216 -16 R0
WINDOW 0 45 -134 Bottom 2
SYMATTR InstName X2
SYMBOL nand 1056 64 R0
WINDOW 0 24 42 Left 2
SYMATTR InstName X3
SYMBOL nand 1056 -192 R0
WINDOW 0 20 45 Left 2
SYMATTR InstName X4
SYMBOL 1_to_4_not 96 704 R0
WINDOW 0 56 -67 Bottom 2
SYMATTR InstName X7
SYMBOL 8_bit_sram_cell 1216 512 R0
WINDOW 0 45 -134 Bottom 2
SYMATTR InstName X8
SYMBOL nand 1056 592 R0
WINDOW 0 24 42 Left 2
SYMATTR InstName X9
SYMBOL nand 1056 336 R0
WINDOW 0 20 45 Left 2
SYMATTR InstName X10
SYMBOL 8_bit_sram_cell 1216 1040 R0
WINDOW 0 45 -134 Bottom 2
SYMATTR InstName X11
SYMBOL nand 1056 1120 R0
WINDOW 0 24 42 Left 2
SYMATTR InstName X12
SYMBOL nand 1056 864 R0
WINDOW 0 20 45 Left 2
SYMATTR InstName X13
SYMBOL 8_bit_sram_cell 1216 1568 R0
WINDOW 0 45 -134 Bottom 2
SYMATTR InstName X15
SYMBOL nand 1056 1648 R0
WINDOW 0 24 42 Left 2
SYMATTR InstName X16
SYMBOL nand 1056 1392 R0
WINDOW 0 20 45 Left 2
SYMATTR InstName X17
SYMBOL 8_bit_sram_cell 1776 -16 R0
WINDOW 0 45 -134 Bottom 2
SYMATTR InstName X18
SYMBOL nand 1616 64 R0
WINDOW 0 24 42 Left 2
SYMATTR InstName X19
SYMBOL nand 1616 -192 R0
WINDOW 0 20 45 Left 2
SYMATTR InstName X20
SYMBOL 8_bit_sram_cell 1776 512 R0
WINDOW 0 45 -134 Bottom 2
SYMATTR InstName X21
SYMBOL nand 1616 592 R0
WINDOW 0 24 42 Left 2
SYMATTR InstName X22
SYMBOL nand 1616 336 R0
WINDOW 0 20 45 Left 2
SYMATTR InstName X23
SYMBOL 8_bit_sram_cell 1776 1040 R0
WINDOW 0 45 -134 Bottom 2
SYMATTR InstName X24
SYMBOL nand 1616 1120 R0
WINDOW 0 24 42 Left 2
SYMATTR InstName X25
SYMBOL nand 1616 864 R0
WINDOW 0 20 45 Left 2
SYMATTR InstName X26
SYMBOL 8_bit_sram_cell 1776 1568 R0
WINDOW 0 45 -134 Bottom 2
SYMATTR InstName X27
SYMBOL nand 1616 1648 R0
WINDOW 0 24 42 Left 2
SYMATTR InstName X28
SYMBOL nand 1616 1392 R0
WINDOW 0 20 45 Left 2
SYMATTR InstName X29
SYMBOL 8_bit_sram_cell 2336 -16 R0
WINDOW 0 45 -134 Bottom 2
SYMATTR InstName X30
SYMBOL nand 2176 64 R0
WINDOW 0 24 42 Left 2
SYMATTR InstName X31
SYMBOL nand 2176 -192 R0
WINDOW 0 20 45 Left 2
SYMATTR InstName X32
SYMBOL 8_bit_sram_cell 2336 512 R0
WINDOW 0 45 -134 Bottom 2
SYMATTR InstName X33
SYMBOL nand 2176 592 R0
WINDOW 0 24 42 Left 2
SYMATTR InstName X34
SYMBOL nand 2176 336 R0
WINDOW 0 20 45 Left 2
SYMATTR InstName X35
SYMBOL 8_bit_sram_cell 2336 1040 R0
WINDOW 0 45 -134 Bottom 2
SYMATTR InstName X36
SYMBOL nand 2176 1120 R0
WINDOW 0 24 42 Left 2
SYMATTR InstName X37
SYMBOL nand 2176 864 R0
WINDOW 0 20 45 Left 2
SYMATTR InstName X38
SYMBOL 8_bit_sram_cell 2336 1568 R0
WINDOW 0 45 -134 Bottom 2
SYMATTR InstName X39
SYMBOL nand 2176 1648 R0
WINDOW 0 24 42 Left 2
SYMATTR InstName X40
SYMBOL nand 2176 1392 R0
WINDOW 0 20 45 Left 2
SYMATTR InstName X41
SYMBOL 8_bit_sram_cell 2896 -16 R0
WINDOW 0 45 -134 Bottom 2
SYMATTR InstName X42
SYMBOL nand 2736 64 R0
WINDOW 0 24 42 Left 2
SYMATTR InstName X43
SYMBOL nand 2736 -192 R0
WINDOW 0 20 45 Left 2
SYMATTR InstName X44
SYMBOL 8_bit_sram_cell 2896 512 R0
WINDOW 0 45 -134 Bottom 2
SYMATTR InstName X45
SYMBOL nand 2736 592 R0
WINDOW 0 24 42 Left 2
SYMATTR InstName X46
SYMBOL nand 2736 336 R0
WINDOW 0 20 45 Left 2
SYMATTR InstName X47
SYMBOL 8_bit_sram_cell 2896 1040 R0
WINDOW 0 45 -134 Bottom 2
SYMATTR InstName X48
SYMBOL nand 2736 1120 R0
WINDOW 0 24 42 Left 2
SYMATTR InstName X49
SYMBOL nand 2736 864 R0
WINDOW 0 20 45 Left 2
SYMATTR InstName X50
SYMBOL 8_bit_sram_cell 2896 1568 R0
WINDOW 0 45 -134 Bottom 2
SYMATTR InstName X51
SYMBOL nand 2736 1648 R0
WINDOW 0 24 42 Left 2
SYMATTR InstName X52
SYMBOL nand 2736 1392 R0
WINDOW 0 20 45 Left 2
SYMATTR InstName X53
SYMBOL 1_to_4_buffer 96 1232 R0
SYMATTR InstName X14
TEXT 88 1512 Left 2 ;TODO: these should be called 'oe[n]', not 'cs[n]'
TEXT -184 1176 Left 2 ;TODO: active low

The netlist it stands for:
* sram.asc
XX1 a0 a1 a2 a3 sel0 sel1 sel10 sel11 sel12 sel13 sel14 sel15 sel2 sel3 sel4 sel5 sel6 sel7 sel8 sel9 vdd vss 4_to_16_decoder
XX2 N001 N005 d0 d1 d2 d3 d4 d5 d6 d7 vdd vss 8_bit_sram_cell
XX3 sel0 we3 vdd vss N005 nand  ; pins a b vdd vss out
XX4 sel0 cs3 vdd vss N001 nand  ; pins a b vdd vss out
XX7 ~we we3 we7 we11 we15 vss vdd 1_to_4_not
XX8 N009 N013 d0 d1 d2 d3 d4 d5 d6 d7 vdd vss 8_bit_sram_cell
XX9 sel1 we3 vdd vss N013 nand  ; pins a b vdd vss out
XX10 sel1 cs3 vdd vss N009 nand  ; pins a b vdd vss out
XX11 N017 N021 d0 d1 d2 d3 d4 d5 d6 d7 vdd vss 8_bit_sram_cell
XX12 sel2 we3 vdd vss N021 nand  ; pins a b vdd vss out
XX13 sel2 cs3 vdd vss N017 nand  ; pins a b vdd vss out
XX15 N025 N029 d0 d1 d2 d3 d4 d5 d6 d7 vdd vss 8_bit_sram_cell
XX16 sel3 we3 vdd vss N029 nand  ; pins a b vdd vss out
XX17 sel3 cs3 vdd vss N025 nand  ; pins a b vdd vss out
XX18 N002 N006 d0 d1 d2 d3 d4 d5 d6 d7 vdd vss 8_bit_sram_cell
XX19 sel4 we7 vdd vss N006 nand  ; pins a b vdd vss out
XX20 sel4 cs7 vdd vss N002 nand  ; pins a b vdd vss out
XX21 N010 N014 d0 d1 d2 d3 d4 d5 d6 d7 vdd vss 8_bit_sram_cell
XX22 sel5 we7 vdd vss N014 nand  ; pins a b vdd vss out
XX23 sel5 cs7 vdd vss N010 nand  ; pins a b vdd vss out
XX24 N018 N022 d0 d1 d2 d3 d4 d5 d6 d7 vdd vss 8_bit_sram_cell
XX25 sel6 we7 vdd vss N022 nand  ; pins a b vdd vss out
XX26 sel6 cs7 vdd vss N018 nand  ; pins a b vdd vss out
XX27 N026 N030 d0 d1 d2 d3 d4 d5 d6 d7 vdd vss 8_bit_sram_cell
XX28 sel7 we7 vdd vss N030 nand  ; pins a b vdd vss out
XX29 sel7 cs7 vdd vss N026 nand  ; pins a b vdd vss out
XX30 N003 N007 d0 d1 d2 d3 d4 d5 d6 d7 vdd vss 8_bit_sram_cell
XX31 sel8 we11 vdd vss N007 nand  ; pins a b vdd vss out
XX32 sel8 cs11 vdd vss N003 nand  ; pins a b vdd vss out
XX33 N011 N015 d0 d1 d2 d3 d4 d5 d6 d7 vdd vss 8_bit_sram_cell
XX34 sel9 we11 vdd vss N015 nand  ; pins a b vdd vss out
XX35 sel9 cs11 vdd vss N011 nand  ; pins a b vdd vss out
XX36 N019 N023 d0 d1 d2 d3 d4 d5 d6 d7 vdd vss 8_bit_sram_cell
XX37 sel10 we11 vdd vss N023 nand  ; pins a b vdd vss out
XX38 sel10 cs11 vdd vss N019 nand  ; pins a b vdd vss out
XX39 N027 N031 d0 d1 d2 d3 d4 d5 d6 d7 vdd vss 8_bit_sram_cell
XX40 sel11 we11 vdd vss N031 nand  ; pins a b vdd vss out
XX41 sel11 cs11 vdd vss N027 nand  ; pins a b vdd vss out
XX42 N004 N008 d0 d1 d2 d3 d4 d5 d6 d7 vdd vss 8_bit_sram_cell
XX43 sel12 we15 vdd vss N008 nand  ; pins a b vdd vss out
XX44 sel12 cs15 vdd vss N004 nand  ; pins a b vdd vss out
XX45 N012 N016 d0 d1 d2 d3 d4 d5 d6 d7 vdd vss 8_bit_sram_cell
XX46 sel13 we15 vdd vss N016 nand  ; pins a b vdd vss out
XX47 sel13 cs15 vdd vss N012 nand  ; pins a b vdd vss out
XX48 N020 N024 d0 d1 d2 d3 d4 d5 d6 d7 vdd vss 8_bit_sram_cell
XX49 sel14 we15 vdd vss N024 nand  ; pins a b vdd vss out
XX50 sel14 cs15 vdd vss N020 nand  ; pins a b vdd vss out
XX51 N028 N032 d0 d1 d2 d3 d4 d5 d6 d7 vdd vss 8_bit_sram_cell
XX52 sel15 we15 vdd vss N032 nand  ; pins a b vdd vss out
XX53 sel15 cs15 vdd vss N028 nand  ; pins a b vdd vss out
XX14 oe cs3 cs7 cs11 cs15 vss vdd 1_to_4_buffer

* block symbol definitions
.subckt 4_to_16_decoder a b c d d0 d1 d10 d11 d12 d13 d14 d15 d2 d3 d4 d5 d6 d7 d8 d9 vdd vss
XX3 a ~a_1 vss vdd not
XX4 a ~a_2 vss vdd not
XX2 a a_2 vss vdd buffer
XX1 a a_1 vss vdd buffer
XX5 b ~b_1 vss vdd not
XX6 b ~b_2 vss vdd not
XX7 b b_2 vss vdd buffer
XX8 b b_1 vss vdd buffer
XX9 c ~c_1 vss vdd not
XX10 c ~c_2 vss vdd not
XX11 c c_2 vss vdd buffer
XX12 c c_1 vss vdd buffer
XX13 d ~d_1 vss vdd not
XX14 d ~d_2 vss vdd not
XX15 d d_2 vss vdd buffer
XX16 d d_1 vss vdd buffer
XX17 a_1 b_1 c_1 d_1 d0 vdd vss 4_way_nor
XX18 ~a_1 b_1 c_1 d_1 d1 vdd vss 4_way_nor
XX19 a_1 ~b_1 c_1 d_1 d2 vdd vss 4_way_nor
XX20 ~a_1 ~b_1 c_1 d_1 d3 vdd vss 4_way_nor
XX21 a_1 b_1 ~c_1 d_2 d4 vdd vss 4_way_nor
XX22 ~a_1 b_1 ~c_1 d_2 d5 vdd vss 4_way_nor
XX23 a_1 ~b_1 ~c_1 d_2 d6 vdd vss 4_way_nor
XX24 ~a_1 ~b_1 ~c_1 d_2 d7 vdd vss 4_way_nor
XX25 a_2 b_2 c_2 ~d_1 d8 vdd vss 4_way_nor
XX26 ~a_2 b_2 c_2 ~d_1 d9 vdd vss 4_way_nor
XX27 a_2 ~b_2 c_2 ~d_1 d10 vdd vss 4_way_nor
XX28 ~a_2 ~b_2 c_2 ~d_1 d11 vdd vss 4_way_nor
XX29 a_2 b_2 ~c_2 ~d_2 d12 vdd vss 4_way_nor
XX30 ~a_2 b_2 ~c_2 ~d_2 d13 vdd vss 4_way_nor
XX31 a_2 ~b_2 ~c_2 ~d_2 d14 vdd vss 4_way_nor
XX32 ~a_2 ~b_2 ~c_2 ~d_2 d15 vdd vss 4_way_nor
.ends 4_to_16_decoder

.subckt not in out vss vdd
R1 vdd out 1k
XX1 out in vss vss nmos_4t
.ends not

.subckt nmos_4t D G S B
M1 d N001 s b nmos_4t_model
C1 d N001 200f
C2 s N001 1p
R1 N001 g 3
.model nmos_4t_model nmos(level=1 vto=2.0 kp = 70e-4 rd = 1m rs = 1m rb = 1m)
.ends nmos_4t

.subckt buffer in out vss vdd
XX3 in N001 vss vdd not
XX1 N001 out vss vdd not
.ends buffer

.subckt 4_way_nor a b c d out vdd vss
R1 vdd out 1k
XX1 out a vss vss nmos_4t
XX2 out b vss vss nmos_4t
XX3 out c vss vss nmos_4t
XX4 out d vss vss nmos_4t
.ends 4_way_nor

.subckt 8_bit_sram_cell ~r ~w d0 d1 d2 d3 d4 d5 d6 d7 vdd vss
XX19 ~r N004 vss vdd not
XX23 N003 r_2 vss vdd not
XX25 N003 r_3 vss vdd not
XX24 N003 r_4 vss vdd not
XX26 N003 r_1 vss vdd not
XX18 N004 ~r_2 vss vdd not
XX20 N004 ~r_3 vss vdd not
XX21 N004 ~r_4 vss vdd not
XX22 N004 ~r_1 vss vdd not
XX17 ~r N003 vss vdd buffer
XX9 ~w N002 vss vdd not
XX10 N001 w_2 vss vdd not
XX11 N001 w_3 vss vdd not
XX12 N001 w_4 vss vdd not
XX13 N001 w_1 vss vdd not
XX14 N002 ~w_2 vss vdd not
XX15 N002 ~w_3 vss vdd not
XX16 N002 ~w_4 vss vdd not
XX27 N002 ~w_1 vss vdd not
XX28 ~w N001 vss vdd buffer
XX1 r_1 w_1 ~r_1 ~w_1 d0 vdd vss 1_bit_sram_cell
XX2 r_1 w_1 ~r_1 ~w_1 d1 vdd vss 1_bit_sram_cell
XX3 r_2 w_2 ~r_2 ~w_2 d2 vdd vss 1_bit_sram_cell
XX4 r_2 w_2 ~r_2 ~w_2 d3 vdd vss 1_bit_sram_cell
XX5 r_3 w_3 ~r_3 ~w_3 d4 vdd vss 1_bit_sram_cell
XX6 r_3 w_3 ~r_3 ~w_3 d5 vdd vss 1_bit_sram_cell
XX7 r_4 w_4 ~r_4 ~w_4 d6 vdd vss 1_bit_sram_cell
XX8 r_4 w_4 ~r_4 ~w_4 d7 vdd vss 1_bit_sram_cell
* read/write line drivers
* 1-bit sram cells
.ends 8_bit_sram_cell

.subckt 1_bit_sram_cell r w ~r ~w d vdd vss
XX1 N003 N004 N005 N002 vdd vss sr_latch
XX2 N001 ~w vdd vss N003 nor
XX3 ~w N006 vdd vss N004 nor
XX7 w N001 ~w d vdd vss transmission_gate
XX6 r d ~r N002 vdd vss transmission_gate
R1 N005 vss 400k
XX4 N001 N006 vss vdd not
C1 vss N002 1n
.ends 1_bit_sram_cell

.subckt sr_latch r s nq q vdd vss
XX1 q s vdd vss nq nor
XX2 r nq vdd vss q nor
.ends sr_latch

.subckt nor a b vdd vss out
R1 vdd out 1k
XX1 out a vss vss nmos_4t
XX2 out b vss vss nmos_4t
.ends nor

.subckt transmission_gate e in ~e out vdd vss
XX1 out ~e in vdd pmos_4t  ; pins D G S B
XX2 in e out vss nmos_4t
.ends transmission_gate

.subckt 1_to_4_not in out0 out1 out2 out3 vss vdd
XX1 in out0 vss vdd not
XX2 in out1 vss vdd not
XX3 in out2 vss vdd not
XX4 in out3 vss vdd not
.ends 1_to_4_not

.subckt 1_to_4_buffer in out0 out1 out2 out3 vss vdd
XX5 N001 out0 out1 out2 out3 vss vdd 1_to_4_not
XX6 in N001 vss vdd not
.ends 1_to_4_buffer

.model NMOS NMOS
.model PMOS PMOS
.lib standard.mos
* TODO: these should be called 'oe[n]', not 'cs[n]'
* TODO: active low
.backanno
.end